# EAGLE schematic M.2 SoM breakout board v0.3 (EAGLE 9.6.2)
Assembly variants: EVT, proto-click, DVT

## Sheet 1 of 3
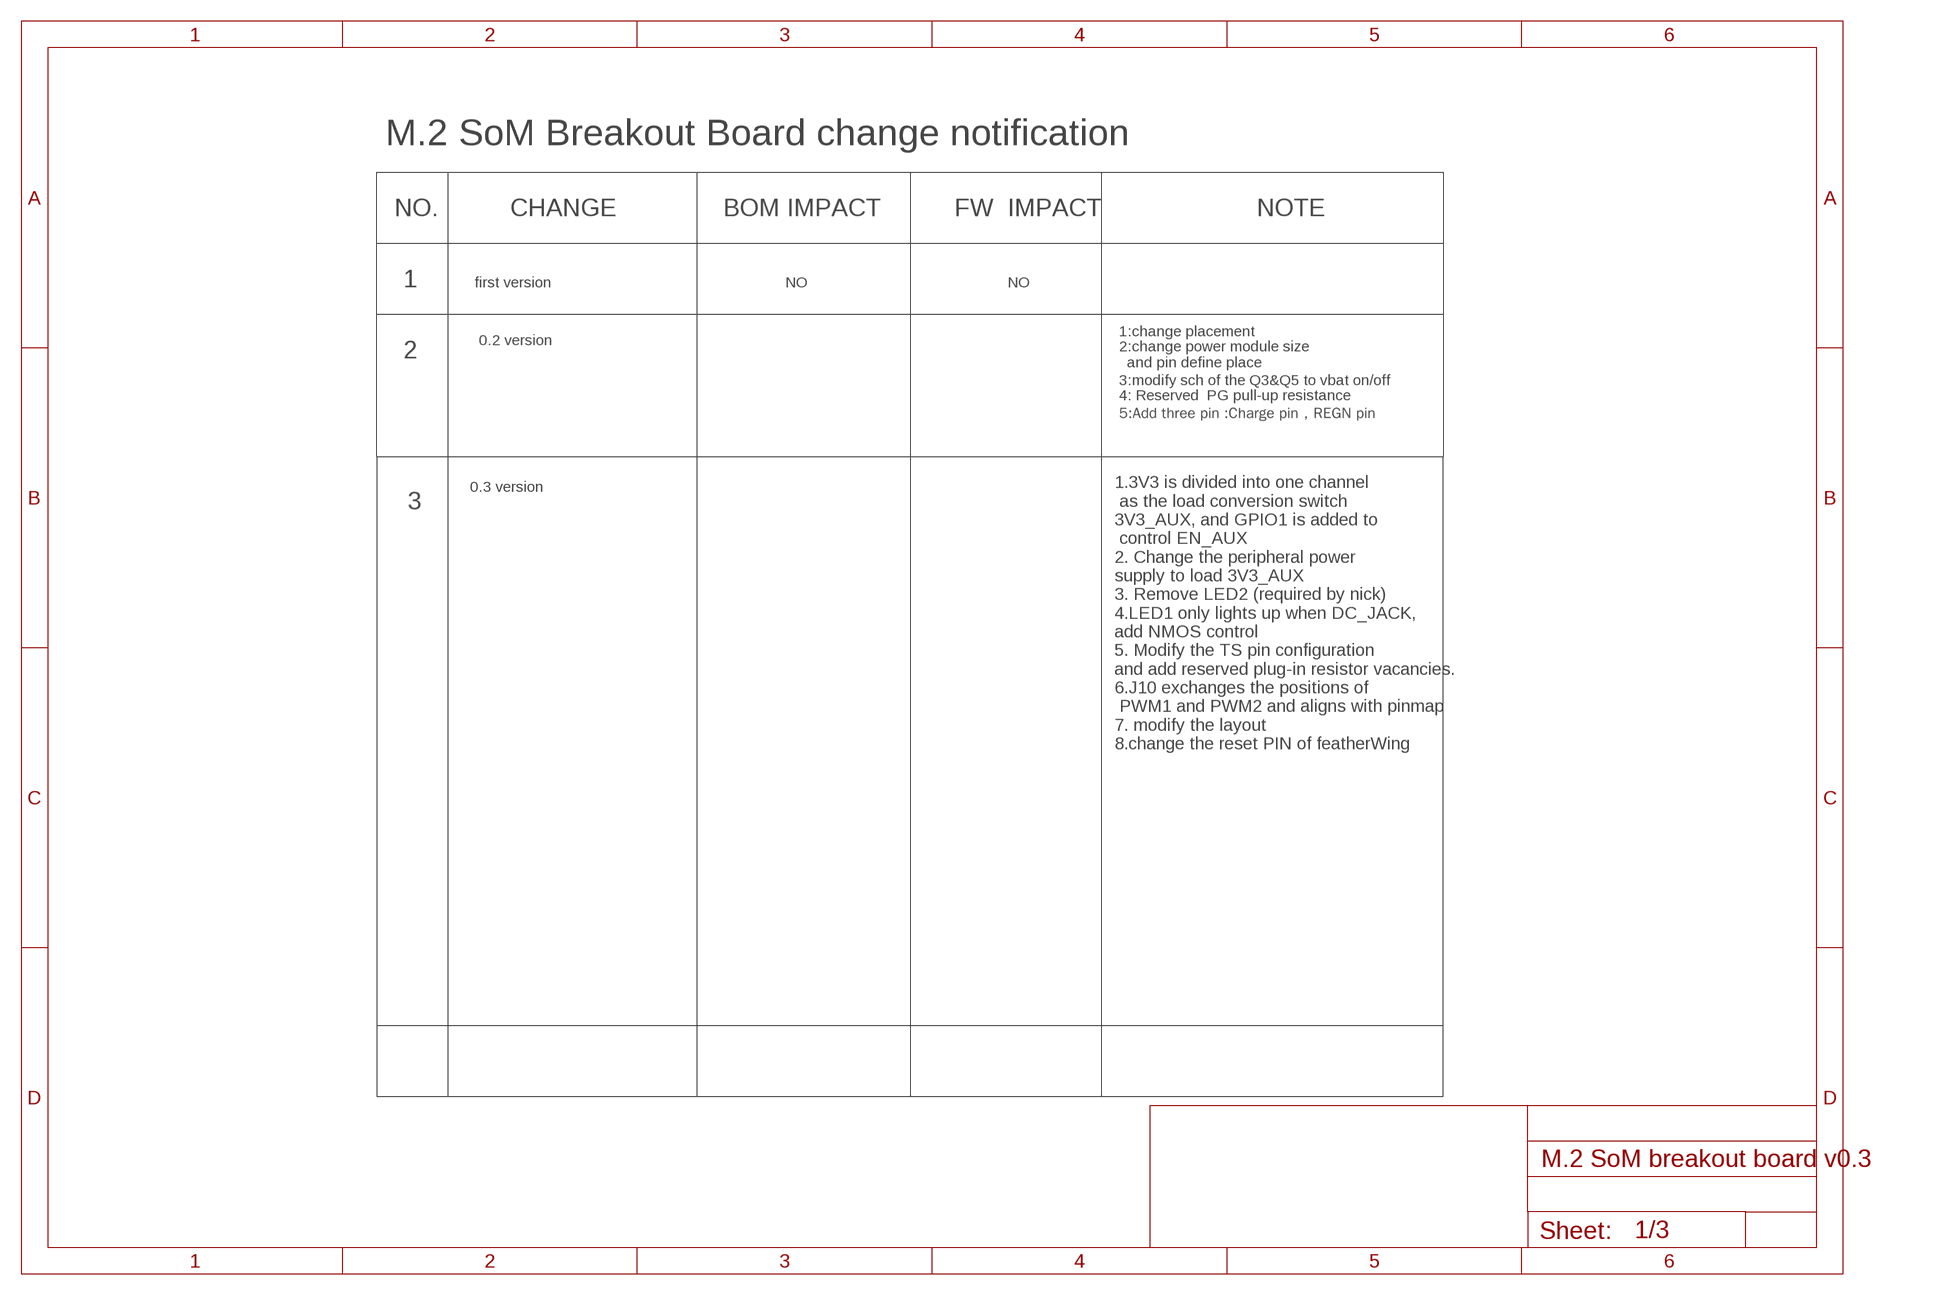
[diagram p0: schematic, sheet 1]

### Notes on the sheet
- M.2 SoM Breakout Board change notification
- NO. | CHANGE | BOM IMPACT | FW  IMPACT | NOTE
- 1 | first version | NO | NO
- 1:change placement
- 0.2 version
- 2
- 2:change power module size
    and pin define place
- 3:modify sch of the Q3&Q5 to vbat on/off
- 4: Reserved  PG pull-up resistance
- 5:Add three pin :Charge pin，REGN pin
- 0.3 version
- 3
- 1.3V3 is divided into one channel
   as the load conversion switch 
  3V3_AUX, and GPIO1 is added to
   control EN_AUX
  2. Change the peripheral power 
  supply to load 3V3_AUX
  3. Remove LED2 (required by nick)
  4.LED1 only lights up when DC_JACK, 
  add NMOS control
  5. Modify the TS pin configuration 
  and add reserved plug-in resistor vacancies.
  6.J10 exchanges the positions of
   PWM1 and PWM2 and aligns with pinmap
  7. modify the layout
  8.change the reset PIN of featherWing

## Sheet 2 of 3: BSOM
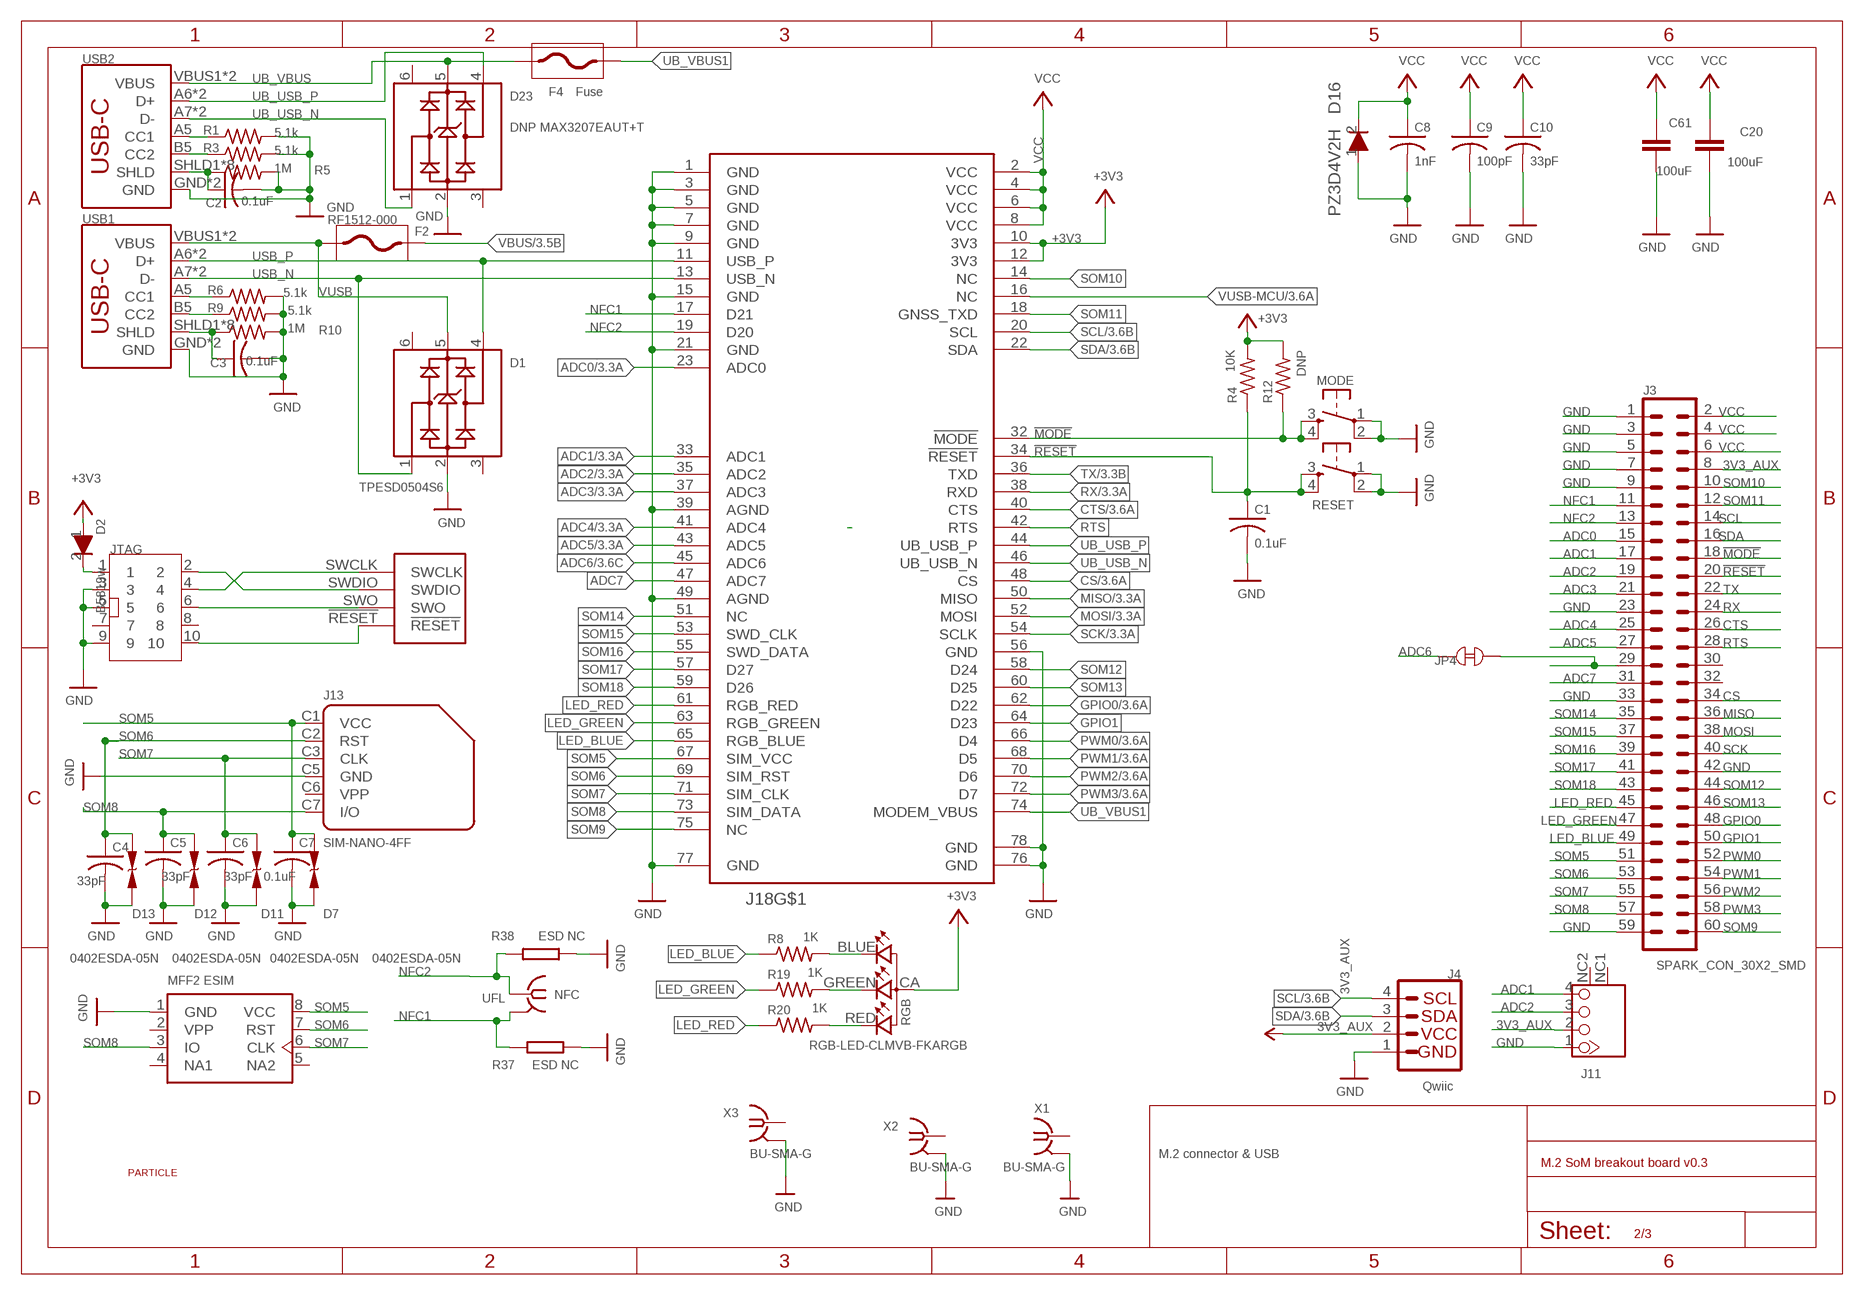
[diagram p1: schematic, sheet 2]

### Parts
C1  0.1uF  C-US  [C0402_B]
C2  0.1uF  C-US  [C0402_B]
C3  0.1uF  C-US  [C0402_B]
C4  33pF  C-US  [C0402_B]
C5  33pF  C-US  [C0402_B]
C6  33pF  C-US  [C0402_B]
C7  0.1uF  C-US  [C0402_B]
C8  1nF  C-US  [C0402_B]
C9  100pF  C-US  [C0402_B]
C10  33pF  C-US  [C0402_B]
C20  100uF  C-EUC1206K  [C1206K]
C61  100uF  C-EUC1206K  [C1206K]
D1  TPESD0504S6  MAX3207EAUT+T  [SOT23-6]
D2  B5819w  DIODESOD123  [SOD-123]
D7  0402ESDA-05N  ESD  [C0402]
D11  0402ESDA-05N  ESD  [C0402]
D12  0402ESDA-05N  ESD  [C0402]
D13  0402ESDA-05N  ESD  [C0402]
D16  PZ3D4V2H  DIODESOD323  [SOD-323]
D23  DNP MAX3207EAUT+T  MAX3207EAUT+T  [SOT23-6]  (not fitted in variant EVT)
F2  RF1512-000  FUSE  [F0805]
F4  Fuse  FUSE  [F0805]
J3  SPARK_CON_30X2_SMD  [SPARK_CON_30X2_SMD]
J4  QWIIC_CONNECTORJS-1MM  [1X04_1MM_RA]
J11  WAFER-HY2.0-4PWB  M.2-SOM-BREAKOUT-BOARD-V0.2-0228_WAFER-HY2.0-4PWB  [M.2-SOM-BREAKOUT-BOARD-V0.2-0228_WAFER-HY2.0-4PWB]
J13  SIM-NANO-4FF  [GCT-SIM8100]
J18  PARTICLE-STUDIOS_M_SERIES_M.2KEY  [PARTICLE-STUDIOS_PARTICLE_M.2EKEY_3.65MM_DRILL]
JP4  TP_SHORT  [TP_SHORT]
JTAG  CONN5X2  [CONN5X2_1.27]  (not fitted in variant EVT)
MODE  TAC_SWITCHSMD  [TACTILE_SWITCH_SMD]
NFC  UFL  IPEX-20279-001E  [IPEX-20279-001E]
R1  5.1k  R-US_  [R0402_B]
R3  5.1k  R-US_  [R0402_B]
R4  10K  R-US_  [R0402_B]
R5  1M  R-US_  [R0402_B]
R6  5.1k  R-US_  [R0402_B]
R8  1K  R-US_  [R0402_B]
R9  5.1k  R-US_  [R0402_B]
R10  1M  R-US_  [R0402_B]
R12  DNP  R-US_  [R0402_B]
R19  1K  R-US_  [R0402_B]
R20  1K  R-US_  [R0402_B]
R37  ESD NC  RES0402S  [R-0402S]
R38  ESD NC  RES0402S  [R-0402S]
RESET  TAC_SWITCHSMD  [TACTILE_SWITCH_SMD]
RGB  RGB-LED-CLMVB-FKARGB  [PLCC4-2MM-RGB]
U7  NC  ESIMSON8  [MFF2]
U$6  PARTICLE-LOGO  [PARTICLE-LOGO]
USB1  USB_C16PIN  [USB-C-16P]
USB2  USB_C16PIN  [USB-C-16P]
X1  BU-SMA-G  [BU-SMA-G]
X2  BU-SMA-G  [BU-SMA-G]
X3  BU-SMA-G  [BU-SMA-G]

### Nets
3V3_AUX: J3.8 J4.2 J11.2 ; also sheet 3
!MODE: J3.18 J18.32(!MODE) MODE.3 MODE.4 R12.1
!RESET: C1.1 J3.20 J18.34(!RESET) J18.!RESET JTAG.10 R4.1 RESET.3 RESET.4 ; also sheet 3
+3V3: D2.1 J18.10(3V3) J18.12(3V3) R4.2 R12.2 RGB.CA ; also sheet 3
ADC0: J3.15 J18.23(ADC0) ; also sheet 3
ADC1: J3.17 J11.4 J18.33(ADC1) ; also sheet 3
ADC2: J3.19 J11.3 J18.35(ADC2) ; also sheet 3
ADC3: J3.21 J18.37(ADC3) ; also sheet 3
ADC4: J3.25 J18.41(ADC4) ; also sheet 3
ADC5: J3.27 J18.43(ADC5) ; also sheet 3
ADC6: J18.45(ADC6) JP4.2 ; also sheet 3
ADC7: J3.31 J18.47(ADC7)
CS: J3.34 J18.48(CS) ; also sheet 3
CTS: J3.26 J18.40(CTS) ; also sheet 3
GND: C1.2 C2.2 C3.2 C4.2 C5.2 C6.2 C7.2 C8.2 C9.2 C10.2 C20.2 C61.2 D1.2 D7.1 D11.1 D12.1 D13.1 D16.1 D23.2 J3.1 J3.3 J3.5 J3.7 J3.9 J3.23 J3.33 J3.42 J3.59 J4.1 J11.1 J13.C5(GND) J18.1(GND) J18.3(GND) J18.5(GND) J18.7(GND) J18.9(GND) J18.15(GND) J18.21(GND) J18.39(AGND) J18.49(AGND) J18.56(GND) J18.76(GND) J18.77(GND) J18.78(GND) JTAG.3 JTAG.5 JTAG.9 MODE.1 MODE.2 R1.2 R3.2 R5.2 R6.2 R9.2 R10.2 R37.2 R38.1 RESET.1 RESET.2 U7.1(GND) USB1.GND USB1.GND2(GND) USB2.GND USB2.GND2(GND) X1.2 X1.3 X1.4 X1.5 X2.2 X2.3 X2.4 X2.5 X3.2 X3.3 X3.4 X3.5 ; also sheet 3
GPIO0: J3.48 J18.62(D22) ; also sheet 3
GPIO1: J3.50 J18.64(D23) ; also sheet 3
LED_BLUE: J3.49 J18.65(RGB_BLUE) R8.1
LED_BLUE1: R8.2 RGB.BLUE
LED_GREEN: J3.47 J18.63(RGB_GREEN) R19.1
LED_GREEN1: R19.2 RGB.GREEN
LED_RED: J3.45 J18.61(RGB_RED) R20.1
LED_RED1: R20.2 RGB.RED
MISO [SPI]: J3.36 J18.50(MISO) ; also sheet 3
MOSI [SPI]: J3.38 J18.52(MOSI) ; also sheet 3
N$1: R1.1 USB2.A5(CC1)
N$2: R3.1 USB2.B5(CC2)
N$3: C2.1 R5.1 USB2.SHLD1(SHLD) USB2.SHLD2(SHLD) USB2.SHLD3(SHLD) USB2.SHLD4(SHLD) USB2.SHLD5(SHLD) USB2.SHLD6(SHLD) USB2.SHLD7(SHLD) USB2.SHLD8(SHLD)
N$4: R6.1 USB1.A5(CC1)
N$5: R9.1 USB1.B5(CC2)
N$6: D2.2 JTAG.1
N$8: C3.1 R10.1 USB1.SHLD1(SHLD) USB1.SHLD2(SHLD) USB1.SHLD3(SHLD) USB1.SHLD4(SHLD) USB1.SHLD5(SHLD) USB1.SHLD6(SHLD) USB1.SHLD7(SHLD) USB1.SHLD8(SHLD)
N$15: J3.29 JP4.1
NFC1: J3.11 J18.17(D21) NFC.2@1(GND) NFC.2@2(GND) R37.1
NFC2: J3.13 J18.19(D20) NFC.1 R38.2
PWM0: J3.52 J18.66(D4) ; also sheet 3
PWM1: J3.54 J18.68(D5) ; also sheet 3
PWM2: J3.56 J18.70(D6) ; also sheet 3
PWM3: J3.58 J18.72(D7) ; also sheet 3
RTS: J3.28 J18.42(RTS)
RX: J3.24 J18.38(RXD) ; also sheet 3
SCK [SPI]: J3.40 J18.54(SCLK) ; also sheet 3
SCL: J3.14 J4.4 J18.20(SCL) ; also sheet 3
SDA: J3.16 J4.3 J18.22(SDA) ; also sheet 3
SOM5: C7.1 D7.2 J3.51 J13.C1(VCC) J18.67(SIM_VCC) U7.8(VCC)
SOM6: C4.1 D13.2 J3.53 J13.C2(RST) J18.69(SIM_RST) U7.7(RST)
SOM7: C6.1 D11.2 J3.55 J13.C3(CLK) J18.71(SIM_CLK) U7.6(CLK)
SOM8: C5.1 D12.2 J3.57 J13.C7(I/O) J18.73(SIM_DATA) U7.3(IO)
SOM9: J3.60 J18.75(NC)
SOM10: J3.10 J18.14(NC)
SOM11: J3.12 J18.18(GNSS_TXD)
SOM12: J3.44 J18.58(D24)
SOM13: J3.46 J18.60(D25)
SOM14: J3.35 J18.51(NC)
SOM15: J3.37 J18.53(SWD_CLK)
SOM16: J3.39 J18.55(SWD_DATA)
SOM17: J3.41 J18.57(D27)
SOM18: J3.43 J18.59(D26)
SWCLK: J18.SWCLK JTAG.4
SWDIO: J18.SWDIO JTAG.2
SWO: J18.SWO JTAG.6
TX: J3.22 J18.36(TXD) ; also sheet 3
UB_USB_N [90R_Impedance]: D23.1 J18.46(UB_USB_N) USB2.A7(D-) USB2.B7(D-)
UB_USB_P [90R_Impedance]: D23.4 J18.44(UB_USB_P) USB2.A6(D+) USB2.B6(D+)
UB_VBUS: D23.5 F4.P$2 USB2.VBUS1(VBUS) USB2.VBUS2(VBUS)
UB_VBUS1: F4.P$1 J18.74(MODEM_VBUS)
USB_N [90R_Impedance]: D1.1 J18.13(USB_N) USB1.A7(D-) USB1.B7(D-)
USB_P [90R_Impedance]: D1.4 J18.11(USB_P) USB1.A6(D+) USB1.B6(D+)
VBUS: F2.P$2 ; also sheet 3
VCC: C8.1 C9.1 C10.1 C20.1 C61.1 D16.2 J3.2 J3.4 J3.6 J18.2(VCC) J18.4(VCC) J18.6(VCC) J18.8(VCC) ; also sheet 3
VUSB: D1.5 F2.P$1 USB1.VBUS1(VBUS) USB1.VBUS2(VBUS)
VUSB-MCU: J18.16(NC) ; also sheet 3
Unconnected: D1.3 D1.6 D23.3 D23.6 J3.30 J3.32 J11.NC1 J11.NC2 J13.C6(VPP) JTAG.7 JTAG.8 U7.4(NA1) U7.5(NA2) X1.1 X2.1 X3.1

### Notes on the sheet
- MFF2 ESIM
- Qwiic
- M.2 connector & USB

## Sheet 3 of 3: WATCHDOG AND FRAM
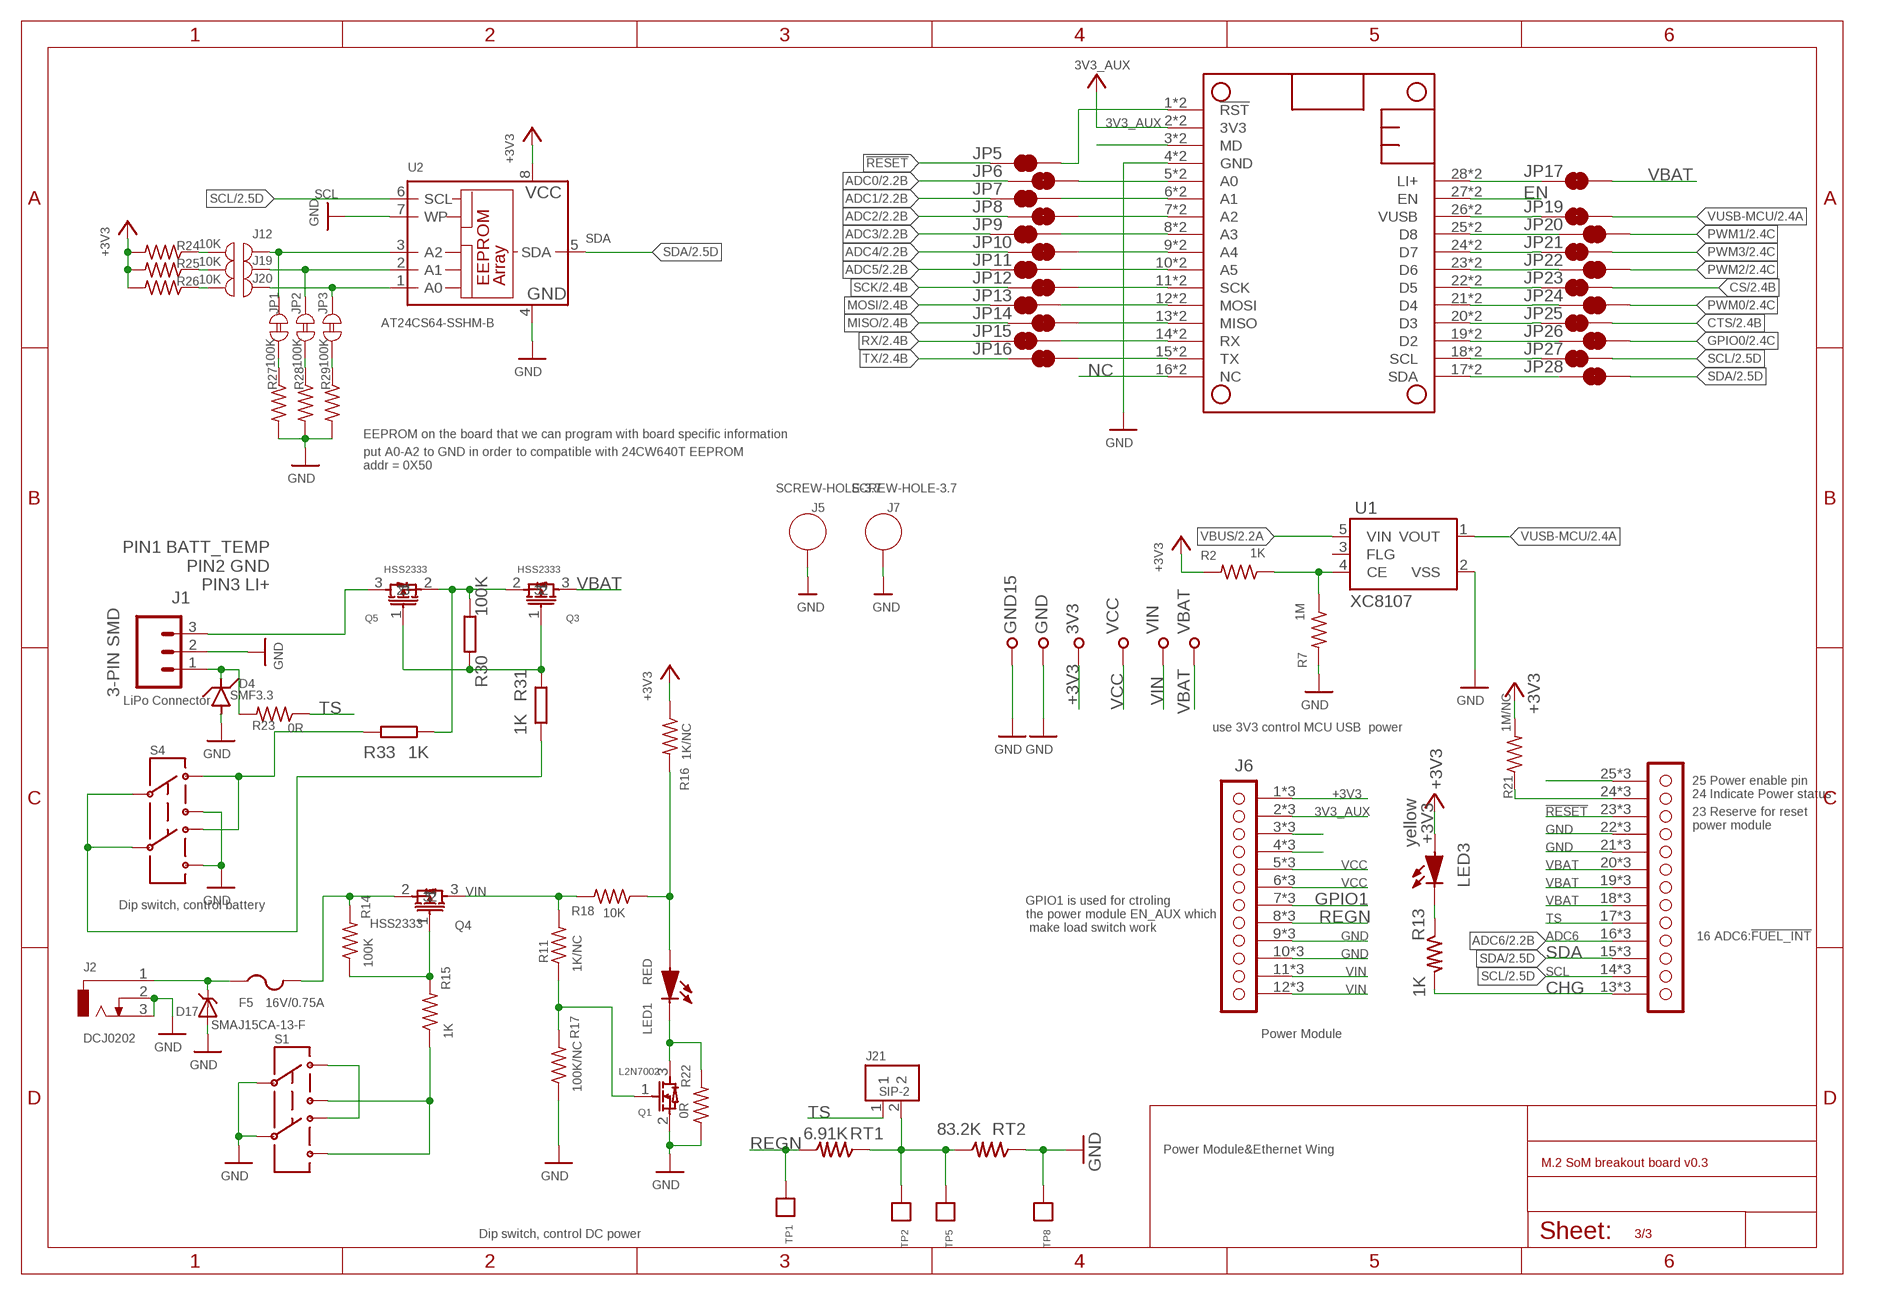
[diagram p2: schematic, sheet 3]

### Parts
3V3  TP-S2751-46R  [S2751-46R]
D4  SMF3.3  TVS-DIODE-SOD123FL  [SOD-123FL]
D17  SMAJ15CA-13-F  DIODE-ZENER  [SMADIODE]
F5  16V/0.75A  PTCFUSE-1812  [1812]
GND  TP-S2751-46R  [S2751-46R]
GND15  TP-S2751-46R  [S2751-46R]
J1  3-PIN SMD  CONN_03JST-SMD  [JST-3-SMD]
J2  DCJ0202  [DCJ0202]
J5  SCREW-HOLE-3.7  [SCREW-HOLE-3.7]
J6  PARTICLE-SZ_PARTICLE-POWER-MODULE  [PARTICLE-SZ_PARTICLE-POWER-MODULE]
J7  SCREW-HOLE-3.7  [SCREW-HOLE-3.7]
J12  TP_OPEN  [TP_OPEN]
J19  TP_OPEN  [TP_OPEN]
J20  TP_OPEN  [TP_OPEN]
J21  SIP-2  [SIP-2]
JP1  TP_SHORT  [TP_SHORT]
JP2  TP_SHORT  [TP_SHORT]
JP3  TP_SHORT  [TP_SHORT]
JP5  JUMPER-SMT_2_NC_TRACE_NO-SILK  [SMT-JUMPER_2_NC_TRACE_NO-SILK]
JP6  JUMPER-SMT_2_NC_TRACE_NO-SILK  [SMT-JUMPER_2_NC_TRACE_NO-SILK]
JP7  JUMPER-SMT_2_NC_TRACE_NO-SILK  [SMT-JUMPER_2_NC_TRACE_NO-SILK]
JP8  JUMPER-SMT_2_NC_TRACE_NO-SILK  [SMT-JUMPER_2_NC_TRACE_NO-SILK]
JP9  JUMPER-SMT_2_NC_TRACE_NO-SILK  [SMT-JUMPER_2_NC_TRACE_NO-SILK]
JP10  JUMPER-SMT_2_NC_TRACE_NO-SILK  [SMT-JUMPER_2_NC_TRACE_NO-SILK]
JP11  JUMPER-SMT_2_NC_TRACE_NO-SILK  [SMT-JUMPER_2_NC_TRACE_NO-SILK]
JP12  JUMPER-SMT_2_NC_TRACE_NO-SILK  [SMT-JUMPER_2_NC_TRACE_NO-SILK]
JP13  JUMPER-SMT_2_NC_TRACE_NO-SILK  [SMT-JUMPER_2_NC_TRACE_NO-SILK]
JP14  JUMPER-SMT_2_NC_TRACE_NO-SILK  [SMT-JUMPER_2_NC_TRACE_NO-SILK]
JP15  JUMPER-SMT_2_NC_TRACE_NO-SILK  [SMT-JUMPER_2_NC_TRACE_NO-SILK]
JP16  JUMPER-SMT_2_NC_TRACE_NO-SILK  [SMT-JUMPER_2_NC_TRACE_NO-SILK]
JP17  JUMPER-SMT_2_NC_TRACE_NO-SILK  [SMT-JUMPER_2_NC_TRACE_NO-SILK]
JP19  JUMPER-SMT_2_NC_TRACE_NO-SILK  [SMT-JUMPER_2_NC_TRACE_NO-SILK]
JP20  JUMPER-SMT_2_NC_TRACE_NO-SILK  [SMT-JUMPER_2_NC_TRACE_NO-SILK]
JP21  JUMPER-SMT_2_NC_TRACE_NO-SILK  [SMT-JUMPER_2_NC_TRACE_NO-SILK]
JP22  JUMPER-SMT_2_NC_TRACE_NO-SILK  [SMT-JUMPER_2_NC_TRACE_NO-SILK]
JP23  JUMPER-SMT_2_NC_TRACE_NO-SILK  [SMT-JUMPER_2_NC_TRACE_NO-SILK]
JP24  JUMPER-SMT_2_NC_TRACE_NO-SILK  [SMT-JUMPER_2_NC_TRACE_NO-SILK]
JP25  JUMPER-SMT_2_NC_TRACE_NO-SILK  [SMT-JUMPER_2_NC_TRACE_NO-SILK]
JP26  JUMPER-SMT_2_NC_TRACE_NO-SILK  [SMT-JUMPER_2_NC_TRACE_NO-SILK]
JP27  JUMPER-SMT_2_NC_TRACE_NO-SILK  [SMT-JUMPER_2_NC_TRACE_NO-SILK]
JP28  JUMPER-SMT_2_NC_TRACE_NO-SILK  [SMT-JUMPER_2_NC_TRACE_NO-SILK]
LED1  RED  LED  [LED0603]
LED3  yellow  LED  [LED0603]
MS1  PARTICLE_MESH_SMTDUAL  [FEATHERWING_SMT2]
Q1  L2N7002  NMOSSOT323  [SOT323]
Q3  HSS2333  PMOS  [SOT-23]
Q4  HSS2333  PMOS  [SOT-23]
Q5  HSS2333  PMOS  [SOT-23]
R2  1K  R-US_  [R0402_B]
R7  1M  R-US_  [R0402_B]
R11  1K/NC  R-US_  [R0402_B]
R13  1K  RES0402S  [R-0402S]
R14  100K  R-US_  [R0402_B]
R15  1K  R-US_  [R0402_B]
R16  1K/NC  R-US_  [R0402_B]
R17  100K/NC  R-US_  [R0402_B]
R18  10K  R-US_  [R0402_B]
R21  1M/NC  R-US_  [R0402_B]
R22  0R  R-US_  [R0402_B]
R23  0R  R-US_  [R0402_B]
R24  10K  R-US_  [R0402_B]
R25  10K  R-US_  [R0402_B]
R26  10K  R-US_  [R0402_B]
R27  100K  R-US_  [R0402_B]
R28  100K  R-US_  [R0402_B]
R29  100K  R-US_  [R0402_B]
R30  100K  RESR0603  [R0603]
R31  1K  RES0402S  [R-0402S]
R33  1K  RES0402S  [R-0402S]
RT1  6.91K  RESR0603A  [R-0603A]
RT2  83.2K  RESR0603A  [R-0603A]
S1  SWITCH-DPDT  [SWITCH-2.5X3.2-6]
S4  SWITCH-DPDT  [SWITCH-2.5X3.2-6]
TP1  TPTPEB  [TPEB]
TP2  TPTPEB  [TPEB]
TP5  TPTPEB  [TPEB]
TP8  TPTPEB  [TPEB]
U1  XC8107  XC8107SOT25  [SOT25]
U2  AT24CS64-SSHM-B  24AA01SN  [SO-08]  (not fitted in variant proto-click)
VBAT  TP-S2751-46R  [S2751-46R]
VCC  TP-S2751-46R  [S2751-46R]
VIN  TP-S2751-46R  [S2751-46R]

### Nets
3V3_AUX: J6.2(3V3) J6.@2(3V3) J6.P$2(3V3) MS1.2'(3V3) MS1.2(3V3) ; also sheet 2
!RESET: J6.23(!RST) J6.@23(!RST) J6.P$23(!RST) JP5.1 ; also sheet 2
+3V3: 3V3.1(TP) J6.1(3V3) J6.@1(3V3) J6.P$1(3V3) LED3.1(A) R2.2 R16.1 R21.2 R24.2 R25.2 R26.2 U2.8(VCC) ; also sheet 2
ADC0: JP6.1 ; also sheet 2
ADC1: JP7.1 ; also sheet 2
ADC2: JP8.1 ; also sheet 2
ADC3: JP9.1 ; also sheet 2
ADC4: JP10.1 ; also sheet 2
ADC5: JP11.1 ; also sheet 2
ADC6: J6.16(!FUEL-INT) J6.@16(!FUEL-INT) J6.P$16(!FUEL-INT) ; also sheet 2
CHG: J6.13(CHG) J6.@13(CHG) J6.P$13(CHG) R13.2
CS: JP23.2 ; also sheet 2
CTS: JP25.2 ; also sheet 2
EN: MS1.27'(EN) MS1.27(EN)
GND: D4.A D17.A GND15.1(TP) GND.1(TP) J1.2 J2.2 J2.3 J5.P$1(GND) J6.9(GND) J6.10(GND) J6.21(GND) J6.22(GND) J6.@9(GND) J6.@10(GND) J6.@21(GND) J6.@22(GND) J6.P$9(GND) J6.P$10(GND) J6.P$21(GND) J6.P$22(GND) J7.P$1(GND) MS1.4'(GND) MS1.4(GND) Q1.2 R7.2 R17.1 R22.1 R27.2 R28.2 R29.2 RT2.1 S1.2 S1.5 S4.3 S4.6 TP8.1 U1.2(VSS) U2.4(GND) U2.7(WP) ; also sheet 2
GPIO0: JP26.2 ; also sheet 2
GPIO1: J6.7(REGN) J6.@7(REGN) J6.P$7(REGN) ; also sheet 2
LI+: JP17.1 MS1.28'(LI+) MS1.28(LI+)
MISO [SPI]: JP14.1 ; also sheet 2
MOSI [SPI]: JP13.1 ; also sheet 2
N$7: MS1.3'(MD) MS1.3(MD)
N$9: R2.1 R7.1 U1.4(CE)
N$11: F5.2 Q4.2 R14.2
N$12: LED3.2(K) R13.1
N$13: J21.2 RT1.1 RT2.2 TP2.1 TP5.1
N$16: JP21.1 MS1.24'(D7) MS1.24(D7)
N$17: Q4.1 R14.1 R15.2
N$18: LED1.1(A) R16.2 R18.1
N$19: Q1.1 R11.1 R17.2
N$20: R33.1 S4.1 S4.4
N$21: JP6.2 MS1.5'(A0) MS1.5(A0)
N$22: J6.24(PG) J6.@24(PG) J6.P$24(PG) R21.1
N$23: JP7.2 MS1.6'(A1) MS1.6(A1)
N$24: JP8.2 MS1.7'(A2) MS1.7(A2)
N$25: JP9.2 MS1.8'(A3) MS1.8(A3)
N$26: JP10.2 MS1.9'(A4) MS1.9(A4)
N$27: JP11.2 MS1.10'(A5) MS1.10(A5)
N$28: JP12.2 MS1.11'(SCK) MS1.11(SCK)
N$29: JP13.2 MS1.12'(MOSI) MS1.12(MOSI)
N$30: JP14.2 MS1.13'(MISO) MS1.13(MISO)
N$31: JP15.2 MS1.14'(RX) MS1.14(RX)
N$32: JP16.2 MS1.15'(TX) MS1.15(TX)
N$33: S1.1 S1.4
N$34: JP28.1 MS1.17'(SDA) MS1.17(SDA)
N$35: JP27.1 MS1.18'(SCL) MS1.18(SCL)
N$36: LED1.2(K) Q1.3 R22.2
N$37: JP26.1 MS1.19'(D2) MS1.19(D2)
N$38: JP25.1 MS1.20'(D3) MS1.20(D3)
N$39: JP24.1 MS1.21'(D4) MS1.21(D4)
N$40: JP23.1 MS1.22'(D5) MS1.22(D5)
N$41: JP22.1 MS1.23'(D6) MS1.23(D6)
N$42: JP20.1 MS1.25'(D8) MS1.25(D8)
N$44: J6.3(5DC) J6.@3(5DC) J6.P$3(5DC)
N$45: D17.C F5.1 J2.1
N$46: JP5.2 MS1.1'(!RST) MS1.1(!RST)
N$47: JP1.1 R27.1
N$48: JP2.1 R28.1
N$49: J12.2 JP1.2 U2.3(A2)
N$50: J19.2 JP2.2 U2.2(A1)
N$51: J12.1 R24.1
N$52: J19.1 R25.1
N$53: J20.1 R26.1
N$54: J20.2 JP3.2 U2.1(A0)
N$55: JP3.1 R29.1
N$56: J6.25(ENABLE) J6.@25(ENABLE) J6.P$25(ENABLE)
N$57: R15.1 S1.3 S1.6
N$58: J1.3 Q5.3
N$59: J6.4(5DC) J6.@4(5DC) J6.P$4(5DC)
N$223: D4.C J1.1 R23.2
N$300: Q3.2 Q5.2 R30.2 R33.2
N$301: Q3.1 Q5.1 R30.1 R31.1
N$302: R31.2 S4.2 S4.5
NC: MS1.16'(NC) MS1.16(NC)
PWM0: JP24.2 ; also sheet 2
PWM1: JP20.2 ; also sheet 2
PWM2: JP22.2 ; also sheet 2
PWM3: JP21.2 ; also sheet 2
REGN: J6.8(NC) J6.@8(NC) J6.P$8(NC) RT1.2 TP1.1
RX: JP15.1 ; also sheet 2
SCK [SPI]: JP12.1 ; also sheet 2
SCL: J6.14(SCL) J6.@14(SCL) J6.P$14(SCL) JP27.2 U2.6(SCL) ; also sheet 2
SDA: J6.15(SDA) J6.@15(SDA) J6.P$15(SDA) JP28.2 U2.5(SDA) ; also sheet 2
TS: J6.17(TS) J6.@17(TS) J6.P$17(TS) J21.1 R23.1
TX: JP16.1 ; also sheet 2
V-USB: JP19.1 MS1.26'(VUSB) MS1.26(VUSB)
VBAT: J6.18(VBAT) J6.19(VBAT) J6.20(VBAT) J6.@18(VBAT) J6.@19(VBAT) J6.@20(VBAT) J6.P$18(VBAT) J6.P$19(VBAT) J6.P$20(VBAT) JP17.2 Q3.3 VBAT.1(TP)
VBUS: U1.5(VIN) ; also sheet 2
VCC: J6.5(VCC) J6.6(VCC) J6.@5(VCC) J6.@6(VCC) J6.P$5(VCC) J6.P$6(VCC) VCC.1(TP) ; also sheet 2
VIN: J6.11(VIN) J6.12(VIN) J6.@11(VIN) J6.@12(VIN) J6.P$11(VIN) J6.P$12(VIN) Q4.3 R11.2 R18.2 VIN.1(TP)
VUSB-MCU: JP19.2 U1.1(VOUT) ; also sheet 2
Unconnected: U1.3(FLG)

### Notes on the sheet
- EEPROM on the board that we can program with board specific information
- put A0-A2 to GND in order to compatible with 24CW640T EEPROM
  addr = 0X50
- PIN1 BATT_TEMP
  PIN2 GND
  PIN3 LI+
- LiPo Connector
- use 3V3 control MCU USB  power
- 25 Power enable pin
- 24 Indicate Power status
- 23 Reserve for reset 
  power module
- Dip switch, control battery
- GPIO1 is used for ctroling 
  the power module EN_AUX which
   make load switch work
- 16 ADC6:!FUEL_INT
- Power Module
- Power Module&Ethernet Wing
- Dip switch, control DC power

## Power pins joined to a net without a drawn wire
VPP: U7.2(VPP)

## Library data of the parts
3V3 GND GND15 VBAT VCC VIN = particle-studios:TP
C1-C10 = Particle:C-US: Capacitor
C20 C61 = rcl:C-EU: CAPACITOR, European symbol; SPICEPREFIX: C
D1 D23 = particle-studios:MAX3207; DESP: TVS DIODE SOT23-6; MFG: MAXIM; MPN: MAX3207EAUT+T; PPN: PC-201321
D2 D16 = particle SZ:DIODE: DIODE
D4 = particle-studios:TVS-DIODE-SOD123
D7 D11-D13 = particle SZ:ESD
D17 = particle-studios:DIODE-ZENER
F2 F4 = RedBear:FUSE
F5 = adafruit:PTCFUSE: PTC fuses, resettable thermistors
J1 = SparkFun-Connectors:CONN_03: Multi connection point. Often used as Generic Header-pin footprint for 0.1 inch spaced/style header connections On any of the 0.1 inch spaced packages, you can populate with these: Break Away Headers - Straight <https://www.sparkfun.com/products/116> (PRT-00116) Break Away Male Headers - Right Angle <https://www.sparkfun.com/products/553> (PRT-00553) Female Headers <https://www.sparkfun.com/products/115> (PRT-00115) Break Away Headers - Machine Pin <https://www.sparkfun.com/products/117> (PRT-00117) Break Away Female Headers - Swiss Machine Pin <https://www.sparkfun.com/products/743> (PRT-00743) Stackable Header - 3 Pin (Female, 0.1") <https://www.sparkfun.com/products/13875> (PRT-13875) For SCREWTERMINALS and SPRING TERMINALS visit here: Screw Terimnals on SparkFun.com <https://www.sparkfun.com/search/results?term=Screw+Terminals> (5mm/3.5mm/2.54mm spacing) This device is also useful as a general connection point to wire up your design to another part of your project. Our various solder wires solder well into these plated through hole pads. Hook-Up Wire - Assortment (Stranded, 22 AWG) <https://www.sparkfun.com/products/11375> (PRT-11375) Hook-Up Wire - Assortment (Solid Core, 22 AWG) <https://www.sparkfun.com/products/11367> (PRT-11367) View the entire wire category on our website here <https://www.sparkfun.com/categories/141> Special notes: Molex polarized connector foot print use with SKU : PRT-08232 with associated crimp pins and housings.; PROD_ID: CONN-12591
J2 = con-jack:DCJ0202: DC POWER JACK Source: DCJ0202.pdf; OC_FARNELL: unknown; OC_NEWARK: unknown
J3 = MESH SOM EVAL BOARD:SPARK_CON_30X2_SMD: CON30*2SMD
J4 = SparkFun-Connectors:QWIIC_CONNECTOR: SparkFun I2C Standard Qwiic Connector An SMD 1mm pitch JST connector makes it easy and quick (get it? Qwiic?) to connect I2C devices to each other. The Qwiic system <http://www.sparkfun.com/qwiic> enables fast and solderless connection between popular platforms and various sensors and actuators. We carry 200mm <https://www.sparkfun.com/products/14204>, 100mm <https://www.sparkfun.com/products/14205>, 50mm <https://www.sparkfun.com/products/14206>, and breadboard friendly <https://www.sparkfun.com/products/14207> Qwiic cables. We also offer 10 pcs strips <https://www.sparkfun.com/products/14323> the SMD connectors.; PROD_ID: CONN-13694
J5 J7 = SOM EVAL BOARD V1.10:SCREW-HOLE-3.7: Screw,Drill diameter 2.6mm
J6 = M.2 SoM breakout board v0.2-0228:PARTICLE-SZ_PARTICLE-POWER-MODULE
J11 = M.2 SoM breakout board v0.3:M.2-SOM-BREAKOUT-BOARD-V0.2-0228_WAFER-HY2.0-4PWB
J12 J19 J20 = particle SZ:TP_OPEN
J13 = Bretts-Spark-Library:SIM-NANO-4FF: SIM NANO 4FF
J18 = M.2 SoM breakout board v0.2-0228:PARTICLE-STUDIOS_M_SERIES_M.2KEY
J21 = particle SZ:SIP-2
JP1-JP4 = particle SZ:TP_SHORT
JP5-JP17 JP19-JP28 = SparkFun-Jumpers:JUMPER-SMT_2_NC_TRACE: Normally closed trace jumper This jumper has a trace between two pads so it's normally closed (NC). Use a razor knife to open the connection. For best results follow the IPC guidelines for cutting traces: Cutout at least 0.063 mm (0.005 in). Remove all loose material to clean up the cut area. Seal the cut with an approved epoxy. Reapply solder to reclose the connection.
JTAG = particle-studios:CONN5X2: 5x2 pin JTAG connector for Particle mesh dev kits; DESP: Connector 2x5pin 1.27mm pitch SMD ROHS; MFG: KAWEEI; MPN: P6014A-M2GC-030-10; PPN: PT-200714
LED1 LED3 = particle SZ:LED: LED
MODE RESET = Particle:TAC_SWITCH: SMD Tactiile Switch; DESP: SWITCH TACTILE SPST-NO 0.3A 12V 160GF 4-SMD; MFG: HAOYU; MPN: TS-1185A-025C; PPN: PT-200911
MS1 = M.2 SoM breakout board v0.1:PARTICLE_MESH
NFC = Particle:IPEX-20279-001E: Ultra Miniature Coaxial SMT RF Receptacle
Q1 = particle SZ:NMOS: NMOS
Q3-Q5 = RedBear:PMOS: PMOS
R1-R12 R14-R29 = Particle:R-US_: 0402 Resistor
R13 RT1 RT2 = particle SZ:RES: RES
R30 R31 R33 R37 R38 = RedBear:RES: RES
RGB = Particle:RGB-LED-CLMVB-FKA: CREE CLMVB-FKA RGB LED 2mm x 2mm
S1 S4 = SparkFun-Retired:SWITCH-DPDT: DPDT Version of the COM-00597
TP1 TP2 TP5 TP8 = particle SZ:TP
U1 = Particle:XC8107
U2 = microchip:24*: Serial EEPROM I2C; MF: MICROCHIP; MPN: 24AA01/SN; OC_FARNELL: 1331268; OC_NEWARK: 89C9792
U7 = Particle:ESIM
U$6 = particle SZ:PARTICLE-LOGO
USB1 USB2 = SparkFun-Connectors:USB_C: USB Type C 16Pin Connector Super Speed pins not available on the 16-pin purely SMD connector so this part is best for USB 2.0 implementations. D1 and D2 are tied together enabling D+/- no matter which way the cable is plugged into the connector. The two channel configuration pins (CC1/2) are exposed. These are normally connected to ground via 5.1k resistors but can be reconfigured for high current/high power applications.; PROD_ID: CONN-14122
X1-X3 = con-coax:BU-SMA-G: FEMALE SMA CONNECTOR Radiall distributor RS 193-9117; OC_FARNELL: unknown; OC_NEWARK: unknown

## Net classes
0 default: width 0.152 mm, drill 0.3 mm, clearance 0.152 mm
1 power: width 0.254 mm, drill 0.61 mm, clearance 0.203 mm
2 90R_Impedance: width 0.152 mm, drill 0.3 mm, clearance 0.152 mm
3 BAT: clearance 0.203 mm